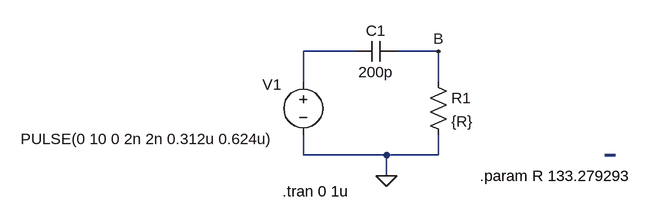
[diagram p0: schematic 3d.asc]
3d.asc, the LTspice schematic file:
Version 4
SHEET 1 988 680
WIRE -32 112 -112 112
WIRE 96 112 32 112
WIRE -112 160 -112 112
WIRE 96 160 96 112
WIRE -112 272 -112 240
WIRE 16 272 -112 272
WIRE 96 272 96 240
WIRE 96 272 16 272
WIRE 16 304 16 272
FLAG 16 304 0
FLAG 96 112 B
BUSTAP 352 272 368 272
SYMBOL voltage -112 144 R0
WINDOW 3 -435 103 Left 2
WINDOW 123 0 0 Left 0
WINDOW 39 0 0 Left 0
WINDOW 0 -63 19 Left 2
SYMATTR Value PULSE(0 10 0 2n 2n 0.312u 0.624u)
SYMATTR InstName V1
SYMBOL res 80 144 R0
SYMATTR InstName R1
SYMATTR Value {R}
SYMBOL cap 32 96 R90
WINDOW 0 0 32 VBottom 2
WINDOW 3 32 32 VTop 2
SYMATTR InstName C1
SYMATTR Value 200p
TEXT 160 304 Left 2 !.param R 133.279293
TEXT -144 328 Left 2 !.tran 0 1u

The netlist it stands for:
* 3d.asc
V1 N001 0 PULSE(0 10 0 2n 2n 0.312u 0.624u)
R1 B 0 {R}
C1 B N001 200p
.param R 133.279293
.tran 0 1u
.backanno
.end